# Altium project ECU V1.0 B.PrjPcb (part 16 of 16)

## Sheet 21_GPIOs_EXP.SchDoc
size A3; SheetNumber: 22; SheetTotal: 22
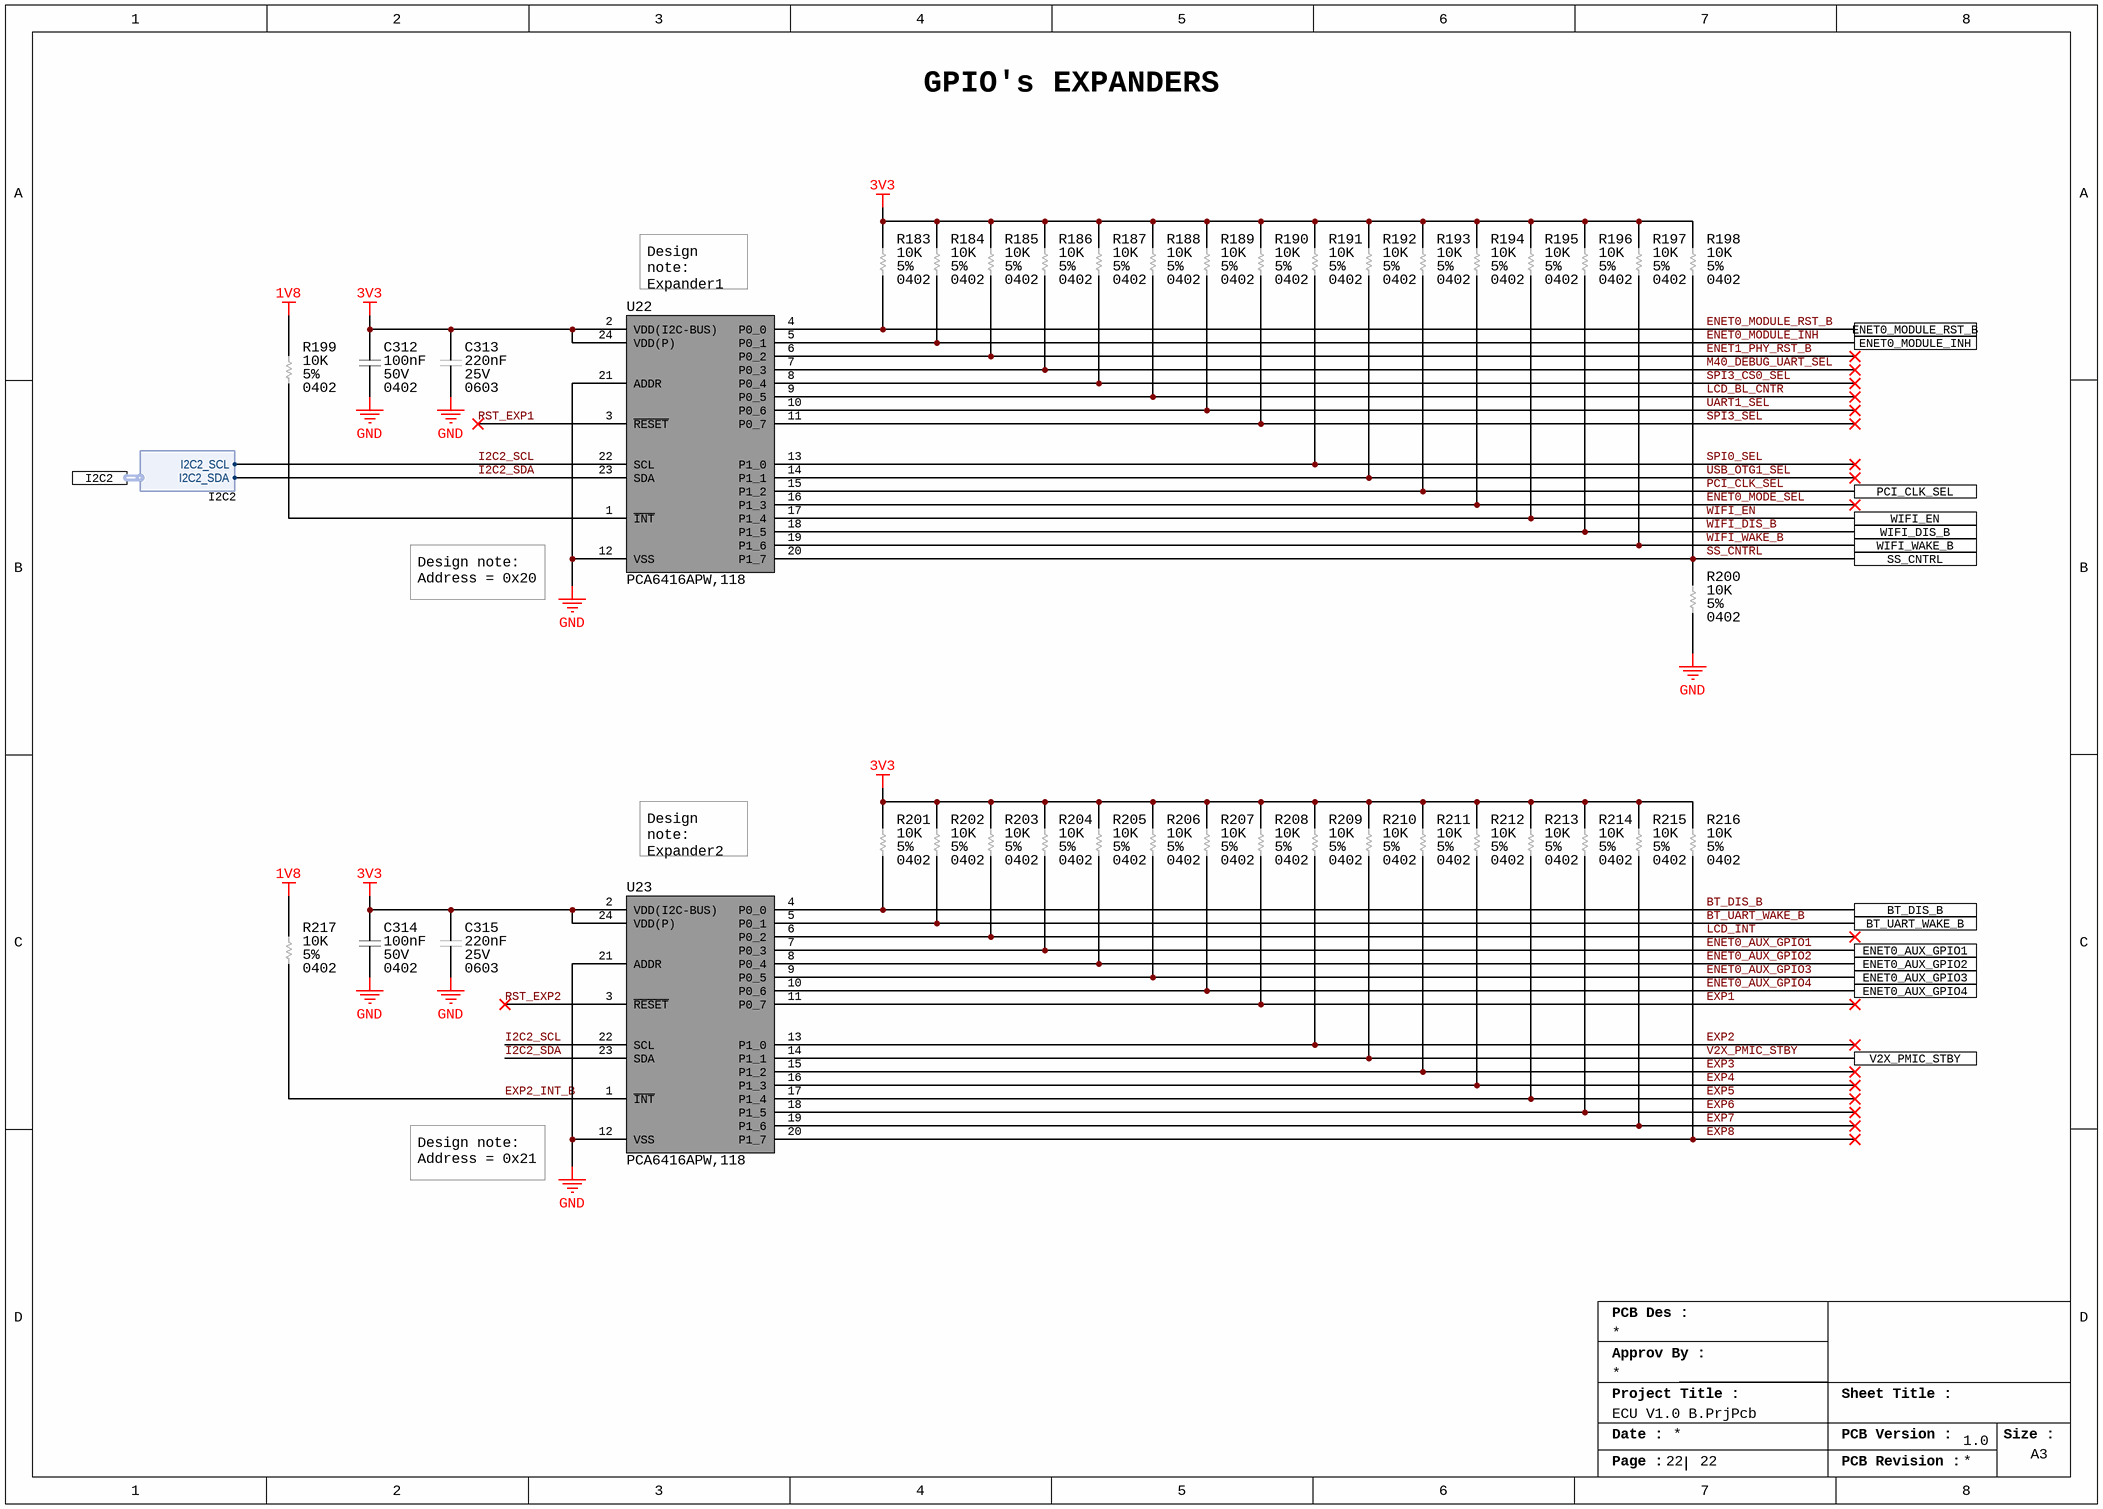
[diagram p22: 21_GPIOs_EXP.SchDoc]

### Parts
C312  Voltage Rating: 50V  Capacitance: 100nF  Case/Package: 0402  [CAP_0402_CAPC1005X05N]  (hidden comment: GRM155R71H104KE14D)
C313  Case/Package: 0603  Voltage Rating: 25V  Capacitance: 220nF  [CAP_0603_CAPC1608X08N]  (hidden comment: GRM188R71E224KA88D)
C314  Voltage Rating: 50V  Capacitance: 100nF  Case/Package: 0402  [CAP_0402_CAPC1005X05N]  (hidden comment: GRM155R71H104KE14D)
C315  Case/Package: 0603  Voltage Rating: 25V  Capacitance: 220nF  [CAP_0603_CAPC1608X08N]  (hidden comment: GRM188R71E224KA88D)
R183  Tolerance: 5%  Resistance: 10K  Case/Package: 0402  [RES_0402_RESC1005X04N]  (hidden comment: ERJ-2GEJ103X)
R184  Tolerance: 5%  Resistance: 10K  Case/Package: 0402  [RES_0402_RESC1005X04N]  (hidden comment: ERJ-2GEJ103X)
R185  Tolerance: 5%  Resistance: 10K  Case/Package: 0402  [RES_0402_RESC1005X04N]  (hidden comment: ERJ-2GEJ103X)
R186  Tolerance: 5%  Resistance: 10K  Case/Package: 0402  [RES_0402_RESC1005X04N]  (hidden comment: ERJ-2GEJ103X)
R187  Tolerance: 5%  Resistance: 10K  Case/Package: 0402  [RES_0402_RESC1005X04N]  (hidden comment: ERJ-2GEJ103X)
R188  Tolerance: 5%  Resistance: 10K  Case/Package: 0402  [RES_0402_RESC1005X04N]  (hidden comment: ERJ-2GEJ103X)
R189  Tolerance: 5%  Resistance: 10K  Case/Package: 0402  [RES_0402_RESC1005X04N]  (hidden comment: ERJ-2GEJ103X)
R190  Tolerance: 5%  Resistance: 10K  Case/Package: 0402  [RES_0402_RESC1005X04N]  (hidden comment: ERJ-2GEJ103X)
R191  Tolerance: 5%  Resistance: 10K  Case/Package: 0402  [RES_0402_RESC1005X04N]  (hidden comment: ERJ-2GEJ103X)
R192  Tolerance: 5%  Resistance: 10K  Case/Package: 0402  [RES_0402_RESC1005X04N]  (hidden comment: ERJ-2GEJ103X)
R193  Tolerance: 5%  Resistance: 10K  Case/Package: 0402  [RES_0402_RESC1005X04N]  (hidden comment: ERJ-2GEJ103X)
R194  Tolerance: 5%  Resistance: 10K  Case/Package: 0402  [RES_0402_RESC1005X04N]  (hidden comment: ERJ-2GEJ103X)
R195  Tolerance: 5%  Resistance: 10K  Case/Package: 0402  [RES_0402_RESC1005X04N]  (hidden comment: ERJ-2GEJ103X)
R196  Tolerance: 5%  Resistance: 10K  Case/Package: 0402  [RES_0402_RESC1005X04N]  (hidden comment: ERJ-2GEJ103X)
R197  Tolerance: 5%  Resistance: 10K  Case/Package: 0402  [RES_0402_RESC1005X04N]  (hidden comment: ERJ-2GEJ103X)
R198  Tolerance: 5%  Resistance: 10K  Case/Package: 0402  [RES_0402_RESC1005X04N]  (hidden comment: ERJ-2GEJ103X)
R199  Tolerance: 5%  Resistance: 10K  Case/Package: 0402  [RES_0402_RESC1005X04N]  (hidden comment: ERJ-2GEJ103X)
R200  Tolerance: 5%  Resistance: 10K  Case/Package: 0402  [RES_0402_RESC1005X04N]  (hidden comment: ERJ-2GEJ103X)
R201  Tolerance: 5%  Resistance: 10K  Case/Package: 0402  [RES_0402_RESC1005X04N]  (hidden comment: ERJ-2GEJ103X)
R202  Tolerance: 5%  Resistance: 10K  Case/Package: 0402  [RES_0402_RESC1005X04N]  (hidden comment: ERJ-2GEJ103X)
R203  Tolerance: 5%  Resistance: 10K  Case/Package: 0402  [RES_0402_RESC1005X04N]  (hidden comment: ERJ-2GEJ103X)
R204  Tolerance: 5%  Resistance: 10K  Case/Package: 0402  [RES_0402_RESC1005X04N]  (hidden comment: ERJ-2GEJ103X)
R205  Tolerance: 5%  Resistance: 10K  Case/Package: 0402  [RES_0402_RESC1005X04N]  (hidden comment: ERJ-2GEJ103X)
R206  Tolerance: 5%  Resistance: 10K  Case/Package: 0402  [RES_0402_RESC1005X04N]  (hidden comment: ERJ-2GEJ103X)
R207  Tolerance: 5%  Resistance: 10K  Case/Package: 0402  [RES_0402_RESC1005X04N]  (hidden comment: ERJ-2GEJ103X)
R208  Tolerance: 5%  Resistance: 10K  Case/Package: 0402  [RES_0402_RESC1005X04N]  (hidden comment: ERJ-2GEJ103X)
R209  Tolerance: 5%  Resistance: 10K  Case/Package: 0402  [RES_0402_RESC1005X04N]  (hidden comment: ERJ-2GEJ103X)
R210  Tolerance: 5%  Resistance: 10K  Case/Package: 0402  [RES_0402_RESC1005X04N]  (hidden comment: ERJ-2GEJ103X)
R211  Tolerance: 5%  Resistance: 10K  Case/Package: 0402  [RES_0402_RESC1005X04N]  (hidden comment: ERJ-2GEJ103X)
R212  Tolerance: 5%  Resistance: 10K  Case/Package: 0402  [RES_0402_RESC1005X04N]  (hidden comment: ERJ-2GEJ103X)
R213  Tolerance: 5%  Resistance: 10K  Case/Package: 0402  [RES_0402_RESC1005X04N]  (hidden comment: ERJ-2GEJ103X)
R214  Tolerance: 5%  Resistance: 10K  Case/Package: 0402  [RES_0402_RESC1005X04N]  (hidden comment: ERJ-2GEJ103X)
R215  Tolerance: 5%  Resistance: 10K  Case/Package: 0402  [RES_0402_RESC1005X04N]  (hidden comment: ERJ-2GEJ103X)
R216  Tolerance: 5%  Resistance: 10K  Case/Package: 0402  [RES_0402_RESC1005X04N]  (hidden comment: ERJ-2GEJ103X)
R217  Tolerance: 5%  Resistance: 10K  Case/Package: 0402  [RES_0402_RESC1005X04N]  (hidden comment: ERJ-2GEJ103X)
U22  PCA6416APW,118  [PCA6416APW118]
U23  PCA6416APW,118  [PCA6416APW118]

### Ports
BT_DIS_B, BT_UART_WAKE_B, ENET0_AUX_GPIO1, ENET0_AUX_GPIO2, ENET0_AUX_GPIO3, ENET0_AUX_GPIO4, ENET0_MODULE_INH, ENET0_MODULE_RST_B, I2C2 (harness I2C2), PCI_CLK_SEL, SS_CNTRL, V2X_PMIC_STBY, WIFI_DIS_B, WIFI_EN, WIFI_WAKE_B

### Harnesses
I2C2: I2C2_SDA, I2C2_SCL

### Nets
1V8: R199.2 R217.2
3V3: C312.2 C313.2 C314.2 C315.2 R183.2 R184.2 R185.2 R186.2 R187.2 R188.2 R189.2 R190.2 R191.2 R192.2 R193.2 R194.2 R195.2 R196.2 R197.2 R198.2 R201.2 R202.2 R203.2 R204.2 R205.2 R206.2 R207.2 R208.2 R209.2 R210.2 R211.2 R212.2 R213.2 R214.2 R215.2 R216.2 U22.2(VDD(I2C-BUS)) U22.24(VDD(P)) U23.2(VDD(I2C-BUS)) U23.24(VDD(P))
GND: C312.1 C313.1 C314.1 C315.1 R200.1 U22.12(VSS) U22.21(ADDR) U23.12(VSS) U23.21(ADDR)
BT_DIS_B: R201.1 U23.4(P0_0) ; port BT_DIS_B
BT_UART_WAKE_B: R202.1 U23.5(P0_1) ; port BT_UART_WAKE_B
ENET0_AUX_GPIO1: R204.1 U23.7(P0_3) ; port ENET0_AUX_GPIO1
ENET0_AUX_GPIO2: R205.1 U23.8(P0_4) ; port ENET0_AUX_GPIO2
ENET0_AUX_GPIO3: R206.1 U23.9(P0_5) ; port ENET0_AUX_GPIO3
ENET0_AUX_GPIO4: R207.1 U23.10(P0_6) ; port ENET0_AUX_GPIO4
ENET0_MODE_SEL: R194.1 U22.16(P1_3)
ENET0_MODULE_INH: R184.1 U22.5(P0_1) ; port ENET0_MODULE_INH
ENET0_MODULE_RST_B: R183.1 U22.4(P0_0) ; port ENET0_MODULE_RST_B
ENET1_PHY_RST_B: R185.1 U22.6(P0_2)
EXP1: R208.1 U23.11(P0_7)
EXP2: R209.1 U23.13(P1_0)
EXP2_INT_B: R217.1 U23.1(~{INT})
EXP3: R211.1 U23.15(P1_2)
EXP4: R212.1 U23.16(P1_3)
EXP5: R213.1 U23.17(P1_4)
EXP6: R214.1 U23.18(P1_5)
EXP7: R215.1 U23.19(P1_6)
EXP8: R216.1 U23.20(P1_7)
I2C2_SCL: U22.22(SCL) U23.22(SCL) ; port I2C2.I2C2_SCL
I2C2_SDA: U22.23(SDA) U23.23(SDA) ; port I2C2.I2C2_SDA
LCD_BL_CNTR: R188.1 U22.9(P0_5)
LCD_INT: R203.1 U23.6(P0_2)
M40_DEBUG_UART_SEL: R186.1 U22.7(P0_3)
PCI_CLK_SEL: R193.1 U22.15(P1_2) ; port PCI_CLK_SEL
RST_EXP1: U22.3(~{RESET})
RST_EXP2: U23.3(~{RESET})
SPI0_SEL: R191.1 U22.13(P1_0)
SPI3_CS0_SEL: R187.1 U22.8(P0_4)
SPI3_SEL: R190.1 U22.11(P0_7)
SS_CNTRL: R198.1 R200.2 U22.20(P1_7) ; port SS_CNTRL
UART1_SEL: R189.1 U22.10(P0_6)
USB_OTG1_SEL: R192.1 U22.14(P1_1)
V2X_PMIC_STBY: R210.1 U23.14(P1_1) ; port V2X_PMIC_STBY
WIFI_DIS_B: R196.1 U22.18(P1_5) ; port WIFI_DIS_B
WIFI_EN: R195.1 U22.17(P1_4) ; port WIFI_EN
WIFI_WAKE_B: R197.1 U22.19(P1_6) ; port WIFI_WAKE_B
NetR199_1: R199.1 U22.1(~{INT})

### Notes on the sheet
- GPIO's EXPANDERS
- (near U22) Design note:
  Expander1
- Design note:
  Address = 0x20
- Design note:
  Expander2
- Design note:
  Address = 0x21
- PCB Des :
- Approv By :
- Project Title :
- Sheet Title :
- Date :
- PCB Version :
- Size :
- A3
- Page :
- PCB Revision :

### Library data of the parts
C312 C314 = CAP_100NF_50V_X7R_0402: Multilayer Ceramic Capacitor, 0.1 uF, 16 V, ± 10%, X7R, 0402 [1005 Metric]; Manufacturer: Murata; Dissipation Factor: 0.025%; Temperature Coefficient: 30ppm/°C; Supplier 1: DigiKey; Manufacturer Part Number: GRM155R71H104KE14D; RoHS: Yes; Category: Ceramic Capacitors; Stock 1: 13730790; Pricing 1: 1=0.1, 10=0.023, 50=0.0132, 100=0.0102, 500=0.00768, 1000=0.00603, 2500=0.00548, 5000=0.00504 (USD); Mount: Surface Mount; Number of Pins: 2NUMBER; Case Code (Metric): 1005; Material: Ceramic; Case Code (Imperial): 0402; Weight: 0.000212oz; Dielectric Material: Ceramic; Min Operating Temperature: -55°C; Max Operating Temperature: 125°C; Packaging: Tape and Reel; Package Quantity: 10000; Series: GRM; Tolerance: 10%; Dielectric: X7R; Termination: SMD/SMT; Voltage: 50V; Voltage Rating (DC): 50V; Construction: Flat; Length: 1mm; Width: 0.5mm; Height: 0.5mm; Depth: 0.5mm; Thickness: 0.022inch; Reach SVHC Compliant: No; RoHS Compliant: Yes; Lead Free: 5697LeadFree; ComponentLink1URL: http://www.farnell.com/datasheets/2079156.pdf?src-supplier=Farnell; ComponentLink1Description: http://www.farnell.com/datasheets/2079156.pdf?src-supplier=Farnell; ComponentLink2URL: http://www.mouser.com/ds/2/281/c02e-2905.pdf?src-supplier=Mouser; ComponentLink2Description: http://www.mouser.com/ds/2/281/c02e-2905.pdf?src-supplier=Mouser; ComponentLink3URL: http://www.farnell.com/datasheets/2079156.pdf?src-supplier=Newark; ComponentLink3Description: http://www.farnell.com/datasheets/2079156.pdf?src-supplier=Newark; ComponentLink4URL: https://datasheet.octopart.com/GRM155R71H104KE14D-Murata-datasheet-22122223.pdf?src-supplier=Future+Electronics; ComponentLink4Description: https://datasheet.octopart.com/GRM155R71H104KE14D-Murata-datasheet-22122223.pdf?src-supplier=Future+Electronics; ComponentLink5URL: https://search.murata.co.jp/Ceramy/image/img/A01X/G101/ENG/GRM155R71H104KE14-01.pdf?src-supplier=Digi-Key; ComponentLink5Description: https://search.murata.co.jp/Ceramy/image/img/A01X/G101/ENG/GRM155R71H104KE14-01.pdf?src-supplier=Digi-Key; ComponentLink6URL: http://psearch.en.murata.com/capacitor/product/GRM155R71H104KE14%23.pdf?src-supplier=Avnet; ComponentLink6Description: http://psearch.en.murata.com/capacitor/product/GRM155R71H104KE14%23.pdf?src-supplier=Avnet; ComponentLink7URL: https://datasheet.octopart.com/GRM155R71H104KE14D-Murata-datasheet-66077078.pdf?src-supplier=Element14; ComponentLink7Description: https://datasheet.octopart.com/GRM155R71H104KE14D-Murata-datasheet-66077078.pdf?src-supplier=Element14; Supplier Part Number 1: 490-10700-6-ND; Supplier 2: Digikey; Stock 2: 3706055; Pricing 2: 1=0.1, 10=0.037, 50=0.021, 100=0.0162, 500=0.01224, 1000=0.00961, 2500=0.00874, 5000=0.00804 (USD); Halogen Free: 5694HalogenFree; ComponentLink8URL: http://www.mouser.com/ds/2/447/UPY-GPHC_X5R_4V-to-50V_25-1131599.pdf?src-supplier=Mouser; ComponentLink8Description: http://www.mouser.com/ds/2/447/UPY-GPHC_X5R_4V-to-50V_25-1131599.pdf?src-supplier=Mouser; ComponentLink9URL: https://datasheet.octopart.com/CC0402KRX5R8BB104-Yageo-datasheet-137700082.pdf?src-supplier=Future+Electronics; ComponentLink9Description: https://datasheet.octopart.com/CC0402KRX5R8BB104-Yageo-datasheet-137700082.pdf?src-supplier=Future+Electronics; ComponentLink10URL: http://www.yageo.com/documents/recent/UPY-GPHC_X5R_4V-to-50V_25.pdf?src-supplier=Digikey; ComponentLink10Description: http://www.yageo.com/documents/recent/UPY-GPHC_X5R_4V-to-50V_25.pdf?src-supplier=Digikey; ComponentLink11URL: https://datasheet.octopart.com/CC0402KRX5R8BB104-Yageo-datasheet-140260304.pdf?src-supplier=Newark; ComponentLink11Description: https://datasheet.octopart.com/CC0402KRX5R8BB104-Yageo-datasheet-140260304.pdf?src-supplier=Newark; ComponentLink12URL: https://datasheet.octopart.com/CC0402KRX5R8BB104-Yageo-datasheet-170350636.pdf?src-supplier=Future+Electronics; ComponentLink12Description: https://datasheet.octopart.com/CC0402KRX5R8BB104-Yageo-datasheet-170350636.pdf?src-supplier=Future+Electronics; ComponentLink13URL: http://www.yageo.com/documents/recent/UPY-GPHC_X5R_4V-to-50V-16.pdf?src-supplier=Future+Electronics; ComponentLink13Description: http://www.yageo.com/documents/recent/UPY-GPHC_X5R_4V-to-50V-16.pdf?src-supplier=Future+Electronics; Supplier Part Number 2: 311-1697-1-ND
C313 C315 = CAP_0.22uF_25V_X7R_0603: Multilayer Ceramic Capacitor, 0.22 uF, 25 V, ± 10%, X7R, 0603 [1608 Metric]; Manufacturer: Murata; Voltage: 50V; Supplier 1: Mouser; Manufacturer Part Number: GRM188R71E224KA88D; RoHS: Yes; Category: Ceramic Capacitors; Stock 1: 86605; Pricing 1: 1=0.1, 10=0.036, 50=0.036, 100=0.021, 1000=0.019, 10000=0.012 (USD); Mount: Surface Mount; Number of Pins: 2; Case Code (Imperial): 0603; Case Code (Metric): 1608; Material: Ceramic; Min Operating Temperature: -55°C; Max Operating Temperature: 125°C; Tolerance: 10%; Dielectric: X7R; Voltage Rating (DC): 25V; Packaging: Tape and Reel; Package Quantity: 1; Termination: SMD/SMT; Series: GRM; Construction: Flat; Length: 1.6mm; Width: 0.031inch; Height: 0.8mm; Thickness: 0.035inch; Depth: 0.8mm; Radiation Hardening: No; Reach SVHC Compliant: No; RoHS Compliant: Yes; Lead Free: 5697LeadFree; ComponentLink1URL: https://datasheet.ciiva.com/133/grm188r71e224ka88-01-133883.pdf?src-supplier=Digi-Key; ComponentLink1Description: https://datasheet.ciiva.com/133/grm188r71e224ka88-01-133883.pdf?src-supplier=Digi-Key; ComponentLink2URL: https://datasheet.ciiva.com/133/grm188r71e224ka88-01-133884.pdf?src-supplier=Digi-Key; ComponentLink2Description: https://datasheet.ciiva.com/133/grm188r71e224ka88-01-133884.pdf?src-supplier=Digi-Key; ComponentLink3URL: https://datasheet.ciiva.com/5411/product-5411362.pdf?src-supplier=Mouser; ComponentLink3Description: https://datasheet.ciiva.com/5411/product-5411362.pdf?src-supplier=Mouser; ComponentLink4URL: https://datasheet.ciiva.com/11786/0900766b807a1cab-11786308.pdf?src-supplier=Rs; ComponentLink4Description: https://datasheet.ciiva.com/11786/0900766b807a1cab-11786308.pdf?src-supplier=Rs; ComponentLink5URL: https://datasheet.ciiva.com/6068/1784408-6068393.pdf?src-supplier=Farnell; ComponentLink5Description: https://datasheet.ciiva.com/6068/1784408-6068393.pdf?src-supplier=Farnell; ComponentLink6URL: https://datasheet.ciiva.com/3777/1531grm188r71e224ka8823-3777688.pdf?src-supplier=Arrow+Electronics; ComponentLink6Description: https://datasheet.ciiva.com/3777/1531grm188r71e224ka8823-3777688.pdf?src-supplier=Arrow+Electronics; ComponentLink7URL: https://datasheet.ciiva.com/29202/451619-da-01-en-vs-kondensator-0603-29202002.pdf?src-supplier=Conrad; ComponentLink7Description: https://datasheet.ciiva.com/29202/451619-da-01-en-vs-kondensator-0603-29202002.pdf?src-supplier=Conrad; ComponentLink8URL: https://datasheet.ciiva.com/48436/nmgrm-data-en-48436687.pdf?src-supplier=Distrelec; ComponentLink8Description: https://datasheet.ciiva.com/48436/nmgrm-data-en-48436687.pdf?src-supplier=Distrelec; ComponentLink9URL: https://datasheet.ciiva.com/14116/nmgrm-data-en-14116629.pdf?src-supplier=Distrelec; ComponentLink9Description: https://datasheet.ciiva.com/14116/nmgrm-data-en-14116629.pdf?src-supplier=Distrelec; ComponentLink10URL: https://datasheet.ciiva.com/16425/product-16425866.pdf?src-supplier=Future+Electronics; ComponentLink10Description: https://datasheet.ciiva.com/16425/product-16425866.pdf?src-supplier=Future+Electronics; ComponentLink11URL: https://datasheet.ciiva.com/22703/1784408-22703338.pdf?src-supplier=Element14; ComponentLink11Description: https://datasheet.ciiva.com/22703/1784408-22703338.pdf?src-supplier=Element14; ComponentLink12URL: https://datasheet.ciiva.com/7937/1784408-7937645.pdf?src-supplier=Element14; ComponentLink12Description: https://datasheet.ciiva.com/7937/1784408-7937645.pdf?src-supplier=Element14; Supplier Part Number 1: 81-GRM188R71E224KA88
R183-R217 = RES_10K_5%_100mW_0402: Res Thick Film 0402 10K Ohm 5% 1/10W ±200ppm/°C Molded SMD Punched Carrier T/R; Manufacturer: Panasonic; Power Rating: 100mW; Voltage Rating: 50V; Supplier 1: Digi-Key; Manufacturer Part Number: ERJ-2GEJ103X; RoHS: Yes; Category: Chip SMD Resistors; Stock 1: 4696986; Pricing 1: 1=0.1, 10=0.021, 50=0.0132, 100=0.011, 500=0.00744, 1000=0.00639, 5000=0.00464 (USD); Mount: Surface Mount; Contact Plating: Tin; Case Code (Metric): 1005; Case Code (Imperial): 0402; Size Code: 0402; Min Operating Temperature: -55°C; Max Operating Temperature: 155°C; Temperature Coefficient: 200ppm/°C; Packaging: Cut Tape; Resistor Type: Thick Film; Package Quantity: 10000; Number of Terminations: 2; Termination: SMD/SMT; Max Power Dissipation: 100mW; Features: Automotive AEC-Q200; Series: ERJ; Resistance Tolerance: 5%; Technology: THICK FILM; Voltage Rating (DC): 50V; Length: 1mm; Width: 0.5mm; Height: 0.35mm; Depth: 0.5mm; Ratings: AEC-Q200; Radiation Hardening: No; Reach SVHC Compliant: No; RoHS Compliant: Yes; Lead Free: 5697LeadFree; ComponentLink1URL: https://datasheet.ciiva.com/27055/1935721-27055112.pdf?src-supplier=Jameco; ComponentLink1Description: https://datasheet.ciiva.com/27055/1935721-27055112.pdf?src-supplier=Jameco; ComponentLink2URL: https://datasheet.ciiva.com/11821/0900766b80f806dd-11821170.pdf?src-supplier=Rs; ComponentLink2Description: https://datasheet.ciiva.com/11821/0900766b80f806dd-11821170.pdf?src-supplier=Rs; ComponentLink3URL: https://datasheet.ciiva.com/43460/1678796-43460391.pdf?src-supplier=Farnell; ComponentLink3Description: https://datasheet.ciiva.com/43460/1678796-43460391.pdf?src-supplier=Farnell; ComponentLink4URL: https://datasheet.ciiva.com/22785/1678796-22785949.pdf?src-supplier=Farnell; ComponentLink4Description: https://datasheet.ciiva.com/22785/1678796-22785949.pdf?src-supplier=Farnell; ComponentLink5URL: https://datasheet.ciiva.com/46371/1678796-46371910.pdf?src-supplier=Element14; ComponentLink5Description: https://datasheet.ciiva.com/46371/1678796-46371910.pdf?src-supplier=Element14; ComponentLink6URL: https://datasheet.ciiva.com/28514/1678796-28514154.pdf?src-supplier=Element14; ComponentLink6Description: https://datasheet.ciiva.com/28514/1678796-28514154.pdf?src-supplier=Element14; ComponentLink7URL: https://datasheet.ciiva.com/24070/aoa0000ce1-37422-24070679.pdf?src-supplier=Mouser; ComponentLink7Description: https://datasheet.ciiva.com/24070/aoa0000ce1-37422-24070679.pdf?src-supplier=Mouser; ComponentLink8URL: https://datasheet.ciiva.com/16767/70260739-16767130.pdf?src-supplier=Allied+Electronics; ComponentLink8Description: https://datasheet.ciiva.com/16767/70260739-16767130.pdf?src-supplier=Allied+Electronics; ComponentLink9URL: https://datasheet.ciiva.com/16774/70260739-16774504.pdf?src-supplier=Allied+Electronics; ComponentLink9Description: https://datasheet.ciiva.com/16774/70260739-16774504.pdf?src-supplier=Allied+Electronics; ComponentLink10URL: https://datasheet.ciiva.com/9194/aoa0000ce1-9194140.pdf?src-supplier=Avnet; ComponentLink10Description: https://datasheet.ciiva.com/9194/aoa0000ce1-9194140.pdf?src-supplier=Avnet; Supplier Part Number 1: P10KJCT-ND
U22 U23 = IC_EXPANDER_16_PCA6416APW,118: I2C/SMBus Interface 100kHz/400kHz 5.5V 24-Pin TSSOP T/R; Manufacturer: NXP Semiconductors; Number of Channels: 1; Output Current: 10mA; Interface: I2C,SMBus; Operating Supply Current: 200mA; Max Frequency: 100kHz; Frequency: 400kHz; Number of I/Os: 16; Supplier 1: Verical; Manufacturer Part Number: PCA6416APW,118; RoHS: Yes; Category: Interface ICs; Stock 1: 2500; Pricing 1: 2500=0.7457, 5000=0.7272, 7500=0.7138, 12500=0.6896 (USD); Mount: Surface Mount; Case/Package: TSSOP; Number of Pins: 24; Weight: 0.007478oz; Min Operating Temperature: -40°C; Max Operating Temperature: 85°C; Operating Supply Voltage: 5.5V; Packaging: Tape and Reel; Package Quantity: 1; Series: -; Supply Voltage-Nom: 5.5V; Supply Current: 200mA; Lead Free: Lead Free; RoHS Compliant: Yes; ComponentLink1URL: https://datasheet.ciiva.com/12097/pca6416a-211613-12097269.pdf?src-supplier=Mouser; ComponentLink1Description: https://datasheet.ciiva.com/12097/pca6416a-211613-12097269.pdf?src-supplier=Mouser; ComponentLink2URL: https://datasheet.ciiva.com/16297/pca6416a-16297873.pdf?src-supplier=Future+Electronics; ComponentLink2Description: https://datasheet.ciiva.com/16297/pca6416a-16297873.pdf?src-supplier=Future+Electronics; ComponentLink3URL: https://datasheet.ciiva.com/6633/pca6416a-6633197.pdf?src-supplier=Digikey; ComponentLink3Description: https://datasheet.ciiva.com/6633/pca6416a-6633197.pdf?src-supplier=Digikey; ComponentLink4URL: https://datasheet.ciiva.com/6633/pca6416a-6633198.pdf?src-supplier=Digikey; ComponentLink4Description: https://datasheet.ciiva.com/6633/pca6416a-6633198.pdf?src-supplier=Digikey; ComponentLink5URL: https://datasheet.ciiva.com/6633/pca6416a-6633199.pdf?src-supplier=Digikey; ComponentLink5Description: https://datasheet.ciiva.com/6633/pca6416a-6633199.pdf?src-supplier=Digikey; Supplier Part Number 1: PCA6416APW,118

## Nets that join several sheets
1V8: 20_V2X_MODEM (C303.2 R177.1 U18.1), 17_CAN_BUS (C250.2 R96.2 U8.1), 18_ETH (R123.2), 15_eMMC_FLASH (20 pins), 19_WIFI_BLE (15 pins), 06_iMX 8X_CAN (C85.2 C86.2 U1.AG27), 07_iMX 8X_LPDDR4 (L6.1), 08_iMX 8X_MEMORY (11 pins), 10_iMX 8X_ETH (R53.1), 11_iMX 8X_SPI & ADC (12 pins), 12_iMX 8X_USB (L9.1), 05_iMX 8X_PCIE (5 pins), 13_iMX 8X_SYSTEM (J4.3 J5.3), 21_GPIOs_EXP (R199.2 R217.2)
3V3: 20_V2X_MODEM (13 pins), 17_CAN_BUS (5 pins), 18_ETH (7 pins), 15_eMMC_FLASH (C189.2 C190.2 C191.2 U5.E6), 19_WIFI_BLE (29 pins), 09_iMX 8X_SD CARD & V2X (7 pins), 11_iMX 8X_SPI & ADC (L7.1), 12_iMX 8X_USB (L10.1), 05_iMX 8X_PCIE (C83.2 C84.2 U1.L9), 21_GPIOs_EXP (40 pins)
5V0: 20_V2X_MODEM (R179.1 R180.2), 17_CAN_BUS (C245.2 C246.2 C247.1 U7.3)
5V0_PS: 02_PWR IN (22 pins), 03_iMX 8X_PMIC (C45.2 U2.19)
12V0: 20_V2X_MODEM (R178.2), 04_iMX 8X_PWR (R?#1.1 R?#2.1), 02_PWR IN (11 pins)
GND: 20_V2X_MODEM (44 pins), 04_iMX 8X_PWR (149 pins), 17_CAN_BUS (33 pins), 18_ETH (41 pins), 15_eMMC_FLASH (30 pins), 16_LPDDR (97 pins), 19_WIFI_BLE (68 pins), 14_JTAG_DBG (J9.03 J9.05 R84.1 R85.1), 02_PWR IN (57 pins), 03_iMX 8X_PMIC (44 pins), 06_iMX 8X_CAN (C85.1 C86.1), 07_iMX 8X_LPDDR4 (18 pins), 08_iMX 8X_MEMORY (6 pins), 09_iMX 8X_SD CARD & V2X (7 pins), 10_iMX 8X_ETH (C115.1 C116.1 C117.1), 11_iMX 8X_SPI & ADC (15 pins), 12_iMX 8X_USB (10 pins), 05_iMX 8X_PCIE (10 pins), 13_iMX 8X_SYSTEM (11 pins), 21_GPIOs_EXP (9 pins)
VDD_ANA: 14_JTAG_DBG (R80.2 R81.2 R82.2 R83.2), 13_iMX 8X_SYSTEM (J4.1 J5.1 R59.2 R60.2)
VDD_DDR_VDDQ: 16_LPDDR (R90.2 R91.2), 07_iMX 8X_LPDDR4 (24 pins)
3V3_5V0_PS_EN: 04_iMX 8X_PWR (D?.1 Q?.D), 02_PWR IN (U3.22)
BT_DIS_B: 19_WIFI_BLE (J13.54), 21_GPIOs_EXP (R201.1 U23.4)
BT_UART_WAKE_B: 19_WIFI_BLE (J13.20), 21_GPIOs_EXP (R202.1 U23.5)
DDR_CA0_A: 16_LPDDR (U6.H2), 07_iMX 8X_LPDDR4 (U1.W1)
DDR_CA1_A: 16_LPDDR (U6.J2), 07_iMX 8X_LPDDR4 (U1.U1)
DDR_CA2_A: 16_LPDDR (U6.H9), 07_iMX 8X_LPDDR4 (U1.N1)
DDR_CA3_A: 16_LPDDR (U6.H10), 07_iMX 8X_LPDDR4 (U1.N3)
DDR_CA4_A: 16_LPDDR (U6.H11), 07_iMX 8X_LPDDR4 (U1.J1)
DDR_CA5_A: 16_LPDDR (U6.J11), 07_iMX 8X_LPDDR4 (U1.J3)
DDR_CKE0_A: 16_LPDDR (U6.J4), 07_iMX 8X_LPDDR4 (R35.2 U1.T2)
DDR_CLKA_N: 16_LPDDR (U6.J9), 07_iMX 8X_LPDDR4 (U1.K2)
DDR_CLKA_P: 16_LPDDR (U6.J8), 07_iMX 8X_LPDDR4 (U1.L1)
DDR_CS0_A: 16_LPDDR (U6.H4), 07_iMX 8X_LPDDR4 (U1.R1)
DDR_DMI1: 16_LPDDR (U6.C10), 07_iMX 8X_LPDDR4 (U1.AE1)
DDR_DMIO: 16_LPDDR (U6.C3), 07_iMX 8X_LPDDR4 (U1.AN3)
DDR_DQ0: 16_LPDDR (U6.B2), 07_iMX 8X_LPDDR4 (U1.AJ1)
DDR_DQ1: 16_LPDDR (U6.C2), 07_iMX 8X_LPDDR4 (U1.AK2)
DDR_DQ2: 16_LPDDR (U6.E2), 07_iMX 8X_LPDDR4 (U1.AL1)
DDR_DQ3: 16_LPDDR (U6.F2), 07_iMX 8X_LPDDR4 (U1.AM2)
DDR_DQ4: 16_LPDDR (U6.F4), 07_iMX 8X_LPDDR4 (U1.AR3)
DDR_DQ5: 16_LPDDR (U6.C4 U6.E4), 07_iMX 8X_LPDDR4 (U1.AP4 U1.AR5)
DDR_DQ7: 16_LPDDR (U6.B4), 07_iMX 8X_LPDDR4 (U1.AP6)
DDR_DQ8: 16_LPDDR (U6.B11), 07_iMX 8X_LPDDR4 (U1.AJ3)
DDR_DQ9: 16_LPDDR (U6.C11), 07_iMX 8X_LPDDR4 (U1.AH2)
DDR_DQ10: 16_LPDDR (U6.E11), 07_iMX 8X_LPDDR4 (U1.AG1)
DDR_DQ11: 16_LPDDR (U6.F11), 07_iMX 8X_LPDDR4 (U1.AF2)
DDR_DQ12: 16_LPDDR (U6.F9), 07_iMX 8X_LPDDR4 (U1.AC1)
DDR_DQ13: 16_LPDDR (U6.E9), 07_iMX 8X_LPDDR4 (U1.AB2)
DDR_DQ14: 16_LPDDR (U6.C9), 07_iMX 8X_LPDDR4 (U1.AA1)
DDR_DQ15: 16_LPDDR (U6.B9), 07_iMX 8X_LPDDR4 (U1.AA3)
DDR_DQS0_N: 16_LPDDR (U6.E3), 07_iMX 8X_LPDDR4 (U1.AP2)
DDR_DQS0_P: 16_LPDDR (U6.D3), 07_iMX 8X_LPDDR4 (U1.AN1)
DDR_DQS1_N: 16_LPDDR (U6.E10), 07_iMX 8X_LPDDR4 (U1.AD2)
DDR_DQS1_P: 16_LPDDR (U6.D10), 07_iMX 8X_LPDDR4 (U1.AE3)
DRAM_RST: 16_LPDDR (U6.T11), 07_iMX 8X_LPDDR4 (R36.2 U1.H2)
EMMC_CLK: 15_eMMC_FLASH (U5.M6), 08_iMX 8X_MEMORY (R41.2)
EMMC_CMD: 15_eMMC_FLASH (U5.M5), 08_iMX 8X_MEMORY (U1.A27)
EMMC_DAT0: 15_eMMC_FLASH (U5.A3), 08_iMX 8X_MEMORY (U1.A23)
EMMC_DAT1: 15_eMMC_FLASH (U5.A4), 08_iMX 8X_MEMORY (U1.B22)
EMMC_DAT2: 15_eMMC_FLASH (U5.A5), 08_iMX 8X_MEMORY (U1.C21)
EMMC_DAT3: 15_eMMC_FLASH (U5.B2), 08_iMX 8X_MEMORY (U1.B24)
EMMC_DAT4: 15_eMMC_FLASH (U5.B3), 08_iMX 8X_MEMORY (U1.C23)
EMMC_DAT5: 15_eMMC_FLASH (U5.B4), 08_iMX 8X_MEMORY (U1.A25)
EMMC_DAT6: 15_eMMC_FLASH (U5.B5), 08_iMX 8X_MEMORY (U1.B20)
EMMC_DAT7: 15_eMMC_FLASH (U5.B6), 08_iMX 8X_MEMORY (U1.A21)
EMMC_RST_B: 15_eMMC_FLASH (U5.K5), 08_iMX 8X_MEMORY (R40.1 R43.2 R44.2)
EMMC_STROBE: 15_eMMC_FLASH (R89.2), 08_iMX 8X_MEMORY (U1.C25)
ENET0_AUX_GPIO1: 20_V2X_MODEM (U20.13), 21_GPIOs_EXP (R204.1 U23.7)
ENET0_AUX_GPIO2: 20_V2X_MODEM (U20.12), 21_GPIOs_EXP (R205.1 U23.8)
ENET0_AUX_GPIO3: 20_V2X_MODEM (U20.11), 21_GPIOs_EXP (R206.1 U23.9)
ENET0_AUX_GPIO4: 20_V2X_MODEM (U20.10), 21_GPIOs_EXP (R207.1 U23.10)
ENET0_MDC: 20_V2X_MODEM (J14.50), 09_iMX 8X_SD CARD & V2X (U?#3.E33)
ENET0_MDIO: 20_V2X_MODEM (J14.48), 09_iMX 8X_SD CARD & V2X (U?#3.E35)
ENET0_MODULE_INH: 20_V2X_MODEM (J14.43), 21_GPIOs_EXP (R184.1 U22.5)
ENET0_MODULE_RST_B: 20_V2X_MODEM (R174.2), 21_GPIOs_EXP (R183.1 U22.4)
ENET0_REFCLK: 20_V2X_MODEM (J14.04 U17.4), 09_iMX 8X_SD CARD & V2X (R?#5.2)
ENET0_RGMII_RX_CTL: 20_V2X_MODEM (J14.28), 09_iMX 8X_SD CARD & V2X (U?#3.C33)
ENET0_RGMII_RXC: 20_V2X_MODEM (J14.32), 09_iMX 8X_SD CARD & V2X (U?#3.B34)
ENET0_RGMII_RXD0: 20_V2X_MODEM (J14.36), 09_iMX 8X_SD CARD & V2X (U?#3.B32)
ENET0_RGMII_RXD1: 20_V2X_MODEM (J14.38), 09_iMX 8X_SD CARD & V2X (U?#3.A33)
ENET0_RGMII_RXD2: 20_V2X_MODEM (J14.42), 09_iMX 8X_SD CARD & V2X (U?#3.C31)
ENET0_RGMII_RXD3: 20_V2X_MODEM (J14.44), 09_iMX 8X_SD CARD & V2X (U?#3.A31)
ENET0_RGMII_TX_CTL: 20_V2X_MODEM (J14.24), 09_iMX 8X_SD CARD & V2X (U?#3.C35)
ENET0_RGMII_TXC: 20_V2X_MODEM (J14.20), 09_iMX 8X_SD CARD & V2X (U?#3.G27)
ENET0_RGMII_TXD0: 20_V2X_MODEM (J14.16), 09_iMX 8X_SD CARD & V2X (U?#3.J29)
ENET0_RGMII_TXD1: 20_V2X_MODEM (J14.14), 09_iMX 8X_SD CARD & V2X (U?#3.G29)
ENET0_RGMII_TXD2: 20_V2X_MODEM (J14.10), 09_iMX 8X_SD CARD & V2X (U?#3.L29)
ENET0_RGMII_TXD3: 20_V2X_MODEM (J14.08), 09_iMX 8X_SD CARD & V2X (U?#3.N29)
ENET1_RGMII_RX_CTL: 18_ETH (R108.1 R115.2 R121.1), 10_iMX 8X_ETH (U1.J35)
ENET1_RGMII_RXC: 18_ETH (R107.1 R114.2 R116.1), 10_iMX 8X_ETH (U1.G33)
ENET1_RGMII_RXD0: 18_ETH (R103.1 R109.2 R117.1), 10_iMX 8X_ETH (U1.J33)
ENET1_RGMII_RXD1: 18_ETH (R104.1 R110.2 R118.1), 10_iMX 8X_ETH (U1.F34)
ENET1_RGMII_RXD2: 18_ETH (R105.1 R111.2 R119.1), 10_iMX 8X_ETH (U1.H34)
ENET1_RGMII_RXD3: 18_ETH (R106.1 R113.2 R120.1), 10_iMX 8X_ETH (U1.G35)
ENET1_RGMII_TX_CTL: 18_ETH (U9.34), 10_iMX 8X_ETH (R48.2)
ENET1_RGMII_TXC: 18_ETH (U9.35), 10_iMX 8X_ETH (R47.2)
ENET1_RGMII_TXD0: 18_ETH (U9.36), 10_iMX 8X_ETH (R49.2)
ENET1_RGMII_TXD1: 18_ETH (U9.37), 10_iMX 8X_ETH (R50.2)
ENET1_RGMII_TXD2: 18_ETH (U9.38), 10_iMX 8X_ETH (R51.2)
ENET1_RGMII_TXD3: 18_ETH (U9.39), 10_iMX 8X_ETH (R52.2)
FLEXCAN2_RX: 17_CAN_BUS (U8.6), 06_iMX 8X_CAN (U1.AL35)
FLEXCAN2_TX: 17_CAN_BUS (U8.4), 06_iMX 8X_CAN (U1.AL33)
I2C2_SCL: 11_iMX 8X_SPI & ADC (U1.AR17), 21_GPIOs_EXP (U22.22 U23.22)
I2C2_SDA: 11_iMX 8X_SPI & ADC (U1.AP16), 21_GPIOs_EXP (U22.23 U23.23)
I2C3.I2C3_SCL: 20_V2X_MODEM (J14.54), 19_WIFI_BLE (J13.60 U10.13), 02_PWR IN (R68.1 U3.2), 11_iMX 8X_SPI & ADC (U1.AP18)
I2C3.I2C3_SDA: 20_V2X_MODEM (J14.52), 19_WIFI_BLE (J13.58 U10.12), 02_PWR IN (R69.1 U3.3), 11_iMX 8X_SPI & ADC (U1.AR15)
JTAG_SRST_B: 15_eMMC_FLASH (R88.2), 14_JTAG_DBG (J9.10 R80.1), 13_iMX 8X_SYSTEM (U1.AR29)
JTAG_TCK: 14_JTAG_DBG (J9.02 R82.1), 13_iMX 8X_SYSTEM (U1.AR33)
JTAG_TD0: 14_JTAG_DBG (J9.08 R81.1), 13_iMX 8X_SYSTEM (U1.AN31)
JTAG_TDI: 14_JTAG_DBG (J9.04 R85.2), 13_iMX 8X_SYSTEM (U1.AR31)
JTAG_TMS: 14_JTAG_DBG (J9.06), 13_iMX 8X_SYSTEM (U1.AP32)
PCI_CLK_SEL: 19_WIFI_BLE (R154.2 U11.12 U13.12), 21_GPIOs_EXP (R193.1 U22.15)
PCIE0_RX_N: 19_WIFI_BLE (R152.1), 05_iMX 8X_PCIE (U1.B12)
PCIE0_RX_P: 19_WIFI_BLE (R151.1), 05_iMX 8X_PCIE (U1.A13)
PCIE0_TX_N: 19_WIFI_BLE (C283.2), 05_iMX 8X_PCIE (U1.B10)
PCIE0_TX_P: 19_WIFI_BLE (C282.2), 05_iMX 8X_PCIE (U1.A11)
PCIE_CTRL_CLKREQ_B: 19_WIFI_BLE (R168.1 U15.1), 05_iMX 8X_PCIE (U1.C9)
PCIE_CTRL_PERST_B: 19_WIFI_BLE (R153.1), 05_iMX 8X_PCIE (U1.B8)
PCIE_CTRL_WAKE_B: 19_WIFI_BLE (J13.55 R150.1), 05_iMX 8X_PCIE (U1.A9)
PCIE_REF_CLK_N: 19_WIFI_BLE (R137.1), 05_iMX 8X_PCIE (R32.2)
PCIE_REF_CLK_P: 19_WIFI_BLE (R136.1), 05_iMX 8X_PCIE (R31.2)
PMIC.PMIC_INT_B: 03_iMX 8X_PMIC (R18.1), 13_iMX 8X_SYSTEM (U1.AN27)
PMIC.PMIC_ON_REQ: 03_iMX 8X_PMIC (R17.1), 13_iMX 8X_SYSTEM (R57.1 U1.AR19)
PMIC.PMIC_STBY: 03_iMX 8X_PMIC (R15.1), 13_iMX 8X_SYSTEM (U1.AN25)
PMIC.PMIC_WDOG_IN: 03_iMX 8X_PMIC (R19.1), 13_iMX 8X_SYSTEM (U1.AG29)
PMIC_I2C.PMIC_I2C_SCL: 03_iMX 8X_PMIC (U2.11), 13_iMX 8X_SYSTEM (R59.1 U1.AP30)
PMIC_I2C.PMIC_I2C_SDA: 03_iMX 8X_PMIC (U2.10), 13_iMX 8X_SYSTEM (R60.1 U1.AP28)
QSPI0_DATA0: 15_eMMC_FLASH (U4.D3), 08_iMX 8X_MEMORY (U1.AR11)
QSPI0_DATA1: 15_eMMC_FLASH (U4.D2), 08_iMX 8X_MEMORY (U1.AN13)
QSPI0_DATA2: 15_eMMC_FLASH (U4.C4), 08_iMX 8X_MEMORY (R39.1 U1.AN9)
QSPI0_DATA3: 15_eMMC_FLASH (U4.D4), 08_iMX 8X_MEMORY (U1.AN11)
QSPI0_DATA4: 15_eMMC_FLASH (U4.D5), 08_iMX 8X_MEMORY (U1.AP10)
QSPI0_DATA5: 15_eMMC_FLASH (U4.E3), 08_iMX 8X_MEMORY (U1.AP12)
QSPI0_DATA6: 15_eMMC_FLASH (U4.E2), 08_iMX 8X_MEMORY (U1.AR13)
QSPI0_DATA7: 15_eMMC_FLASH (U4.E1), 08_iMX 8X_MEMORY (U1.AP14)
QSPI0_DQS: 15_eMMC_FLASH (U4.C3), 08_iMX 8X_MEMORY (U1.AR9)
QSPI0A_SCLK: 15_eMMC_FLASH (U4.B2), 08_iMX 8X_MEMORY (U1.AP8)
QSPI0A_SS0_B: 15_eMMC_FLASH (R87.2), 08_iMX 8X_MEMORY (R38.1 U1.AN7)
SPI2_CS0: 20_V2X_MODEM (U19.11), 09_iMX 8X_SD CARD & V2X (U?#4.C29)
SPI2_SCK: 20_V2X_MODEM (U19.10), 09_iMX 8X_SD CARD & V2X (U?#4.A29)
SPI2_SD0: 20_V2X_MODEM (U19.13), 09_iMX 8X_SD CARD & V2X (U?#4.B28)
SPI2_SDI: 20_V2X_MODEM (U19.12), 09_iMX 8X_SD CARD & V2X (U?#4.B30)
SS_CNTRL: 19_WIFI_BLE (U14.2), 21_GPIOs_EXP (R198.1 R200.2 U22.20)
UART2_RX: 17_CAN_BUS (U8.5), 06_iMX 8X_CAN (U1.AP34)
UART2_TX: 17_CAN_BUS (U8.7), 06_iMX 8X_CAN (U1.AN33)
V2X_PMIC_STBY: 20_V2X_MODEM (U21.2), 21_GPIOs_EXP (R210.1 U23.14)
WIFI_DIS_B: 19_WIFI_BLE (J13.56), 21_GPIOs_EXP (R196.1 U22.18)
WIFI_EN: 19_WIFI_BLE (U10.10), 21_GPIOs_EXP (R195.1 U22.17)
WIFI_WAKE_B: 19_WIFI_BLE (U10.11), 21_GPIOs_EXP (R197.1 U22.19)

## Assembly variants
Base Variant: not fitted D9 D10 D11 D12 D13 D14 D15 D16 J16 J16 R44 R89 R93 R98 R102 R107 R111 R115 R119